# EAGLE design CNC1000 (EAGLE 6.4)
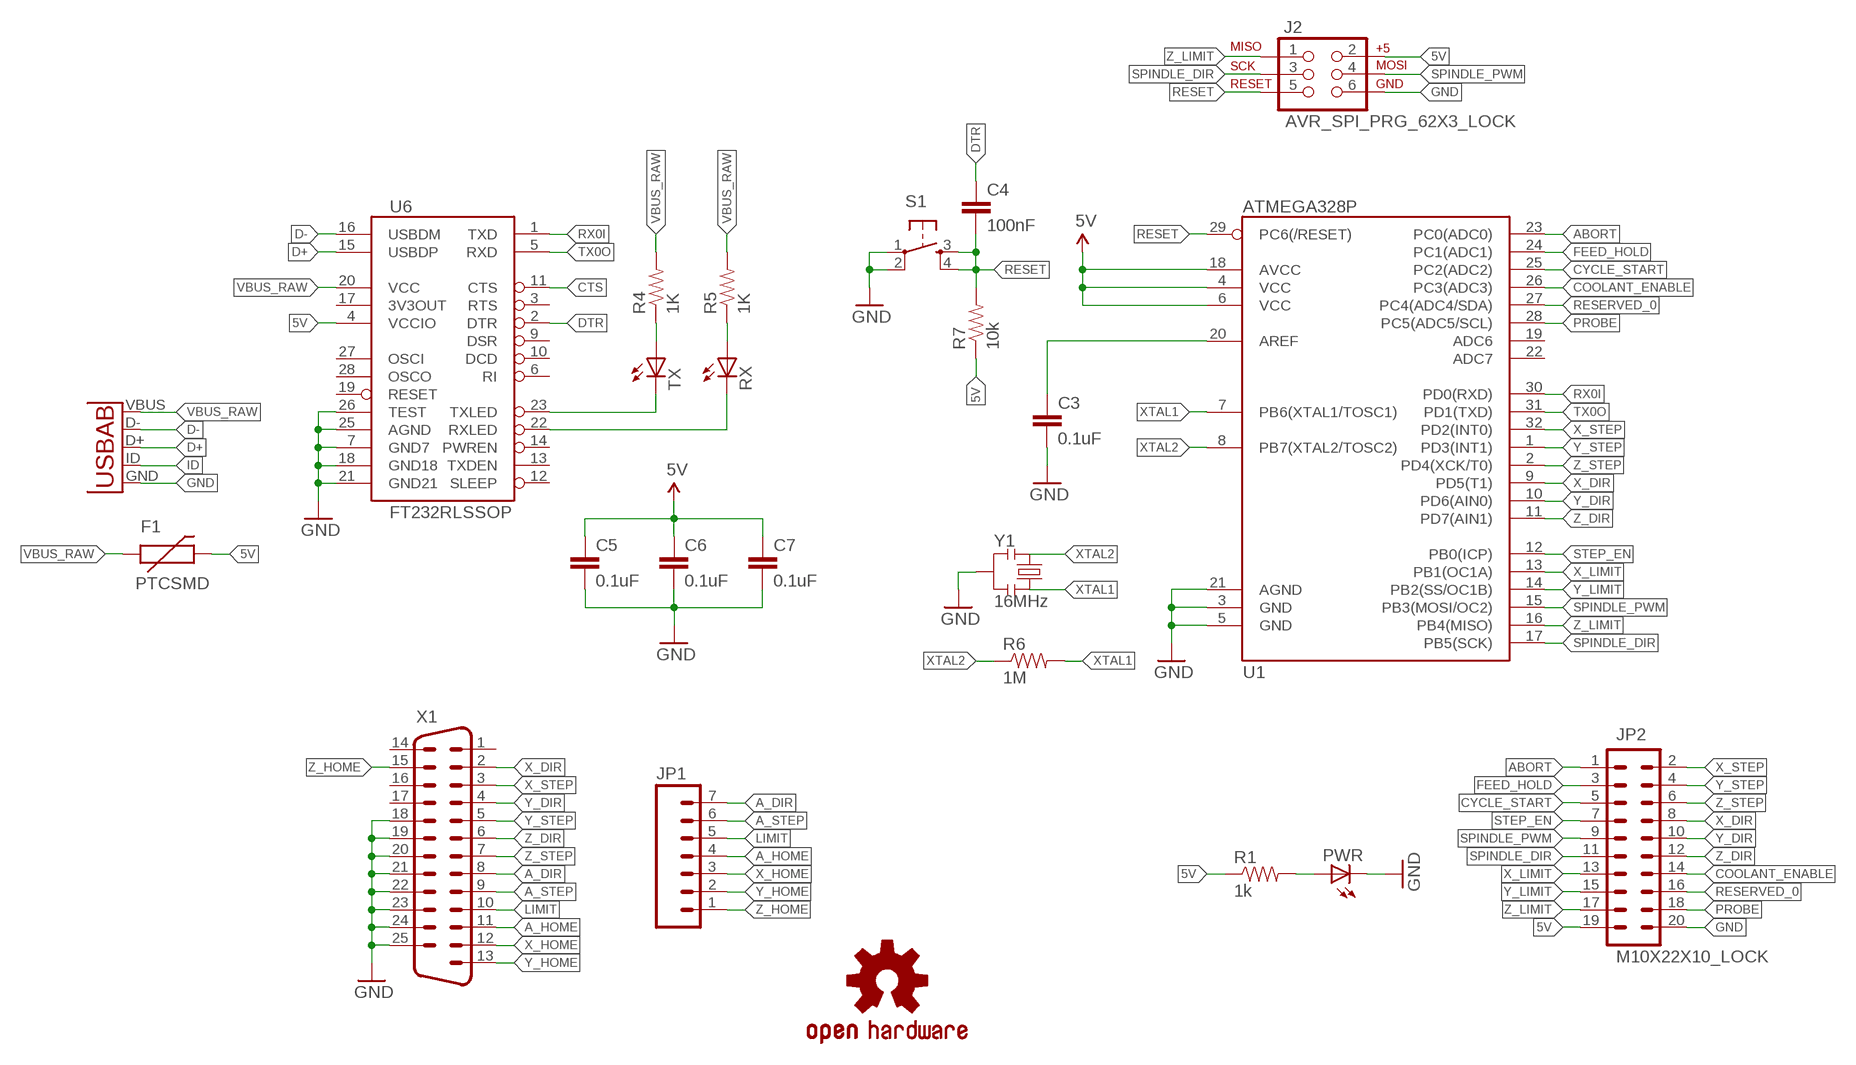
[diagram p0: schematic, sheet 1]

## Parts
C3  0.1uF  CAP0805  [0805]
C4  100nF  CAP0805  [0805]
C5  0.1uF  CAP0805  [0805]
C6  0.1uF  CAP0805  [0805]
C7  0.1uF  CAP0805  [0805]
F1  PTCSMD  [PTC-1206]
J2  AVR_SPI_PRG_62X3_LOCK  [2X3_LOCK]
JP1  M07LOCK  [1X07_LOCK]
JP2  M10X22X10_LOCK  [2X10_LOCK]
LOGO2  OSHW-LOGOM  [OSHW-LOGO-M]
PWR  LED0603  [LED-0603]
R1  1k  RESISTOR0805-RES  [0805]
R4  1K  RESISTOR0805-RES  [0805]
R5  1K  RESISTOR0805-RES  [0805]
R6  1M  RESISTOR0805-RES  [0805]
R7  10k  RESISTOR0805-RES  [0805]
RX  LED0603  [LED-0603]
S1  TAC_SWITCHSMD  [TACTILE_SWITCH_SMD]
TX  LED0603  [LED-0603]
U1  ATMEGA328P  ATMEGA328_SMT  [TQFP32-08]
U4  USB-AB"  [USB_AB_MICRO_1:1_V2]
U6  FT232RLSSOP  [SSOP28DB]
X1  DB25TE  [TE1734350]
Y1  16MHz  PRQC16.00SR1010V00LSMD  [PRQC16.00SR1010V00L]

## Nets
5V: C5.1 C6.1 C7.1 F1.2 J2.2 JP2.19 R1.1 R7.1 U1.4(VCC) U1.6(VCC) U1.18(AVCC) U6.4(VCCIO)
A_DIR: JP1.7 X1.8
A_HOME: JP1.4 X1.11
A_STEP: JP1.6 X1.9
ABORT: JP2.1 U1.23(PC0(ADC0))
COOLANT_ENABLE: JP2.14 U1.26(PC3(ADC3))
CTS: U6.11(CTS)
CYCLE_START: JP2.5 U1.25(PC2(ADC2))
D+: U4.D+ U6.15(USBDP)
D-: U4.D- U6.16(USBDM)
DTR: C4.1 U6.2(DTR)
FEED_HOLD: JP2.3 U1.24(PC1(ADC1))
GND: C3.2 C5.2 C6.2 C7.2 J2.6 JP2.20 PWR.C S1.1 S1.2 U1.3(GND) U1.5(GND) U1.21(AGND) U4.GND U6.7(GND7) U6.18(GND18) U6.21(GND21) U6.25(AGND) U6.26(TEST) X1.18 X1.19 X1.20 X1.21 X1.22 X1.23 X1.24 X1.25 Y1.P$2
ID: U4.ID(USBID)
LIMIT: JP1.5 X1.10
N$1: TX.C U6.23(TXLED)
N$3: RX.C U6.22(RXLED)
N$5: R4.1 TX.A
N$6: R5.1 RX.A
N$7: PWR.A R1.2
N$8: C3.1 U1.20(AREF)
PROBE: JP2.18 U1.28(PC5(ADC5/SCL))
RESERVED_0: JP2.16 U1.27(PC4(ADC4/SDA))
RESET: C4.2 J2.5 R7.2 S1.3 S1.4 U1.29(PC6(/RESET))
RX0I: U1.30(PD0(RXD)) U6.1(TXD)
SPINDLE_DIR: J2.3 JP2.11 U1.17(PB5(SCK))
SPINDLE_PWM: J2.4 JP2.9 U1.15(PB3(MOSI/OC2))
STEP_EN: JP2.7 U1.12(PB0(ICP))
TX0O: U1.31(PD1(TXD)) U6.5(RXD)
VBUS_RAW: F1.1 R4.2 R5.2 U4.VBUS U6.20(VCC)
X_DIR: JP2.8 U1.9(PD5(T1)) X1.2
X_HOME: JP1.3 X1.12
X_LIMIT: JP2.13 U1.13(PB1(OC1A))
X_STEP: JP2.2 U1.32(PD2(INT0)) X1.3
XTAL1: R6.2 U1.7(PB6(XTAL1/TOSC1)) Y1.P$3
XTAL2: R6.1 U1.8(PB7(XTAL2/TOSC2)) Y1.P$1
Y_DIR: JP2.10 U1.10(PD6(AIN0)) X1.4
Y_HOME: JP1.2 X1.13
Y_LIMIT: JP2.15 U1.14(PB2(SS/OC1B))
Y_STEP: JP2.4 U1.1(PD3(INT1)) X1.5
Z_DIR: JP2.12 U1.11(PD7(AIN1)) X1.6
Z_HOME: JP1.1 X1.15
Z_LIMIT: J2.1 JP2.17 U1.16(PB4(MISO))
Z_STEP: JP2.6 U1.2(PD4(XCK/T0)) X1.7
Unconnected: U1.19(ADC6) U1.22(ADC7) U6.3(RTS) U6.6(RI) U6.9(DSR) U6.10(DCD) U6.12(SLEEP) U6.13(TXDEN) U6.14(PWREN) U6.17(3V3OUT) U6.19(RESET) U6.27(OSCI) U6.28(OSCO) X1.1 X1.14 X1.16 X1.17

## Library data of the parts
C3 C4 = SparkFun-Capacitors:CAP: Capacitor Standard 0603 ceramic capacitor, and 0.1" leaded capacitor.
C5-C7 = evanli:CAP: Capacitor Standard 0603 ceramic capacitor, and 0.1" leaded capacitor.
F1 = SparkFun-PowerIC:PTC: Resettable Fuse PTC Resettable Fuse. Spark Fun Electronics SKU : COM-08357; PROD_ID: RES-11150
J2 = SparkFun-Connectors:AVR_SPI_PRG_6: AVR ISP 6 Pin This is the reduced ISP connector for AVR programming. Common on Arduino. This footprint will take up less PCB space and can be used with a 10-pin to 6-pin adapter such as SKU: BOB-08508
JP1 = SparkFun-Connectors:M07: Header 7 Standard 7-pin 0.1" header. Use with straight break away headers (SKU : PRT-00116), right angle break away headers (PRT-00553), swiss pins (PRT-00743), machine pins (PRT-00117), and female headers (PRT-00115). NOTES ON THE VARIANTS LOCK and LOCK_LONGPADS... This footprint was designed to help hold the alignment of a through-hole component (i.e. 7-pin header) while soldering it into place. You may notice that each hole has been shifted either up or down by 0.005 of an inch from it's more standard position (which is usually a perfectly straight line). This slight alteration caused the pins (the squares in the middle) to touch the edges of the holes. Because they are alternating, it causes a "brace" to hold the header in place. 0.005 has proven to be the perfect amount of "off-center" position when using our standard breakaway headers. Although looks a little odd when you look at the bare footprint, once you have a header in there, the alteration is very hard to notice. Also, if you push a header all the way into place, it is covered up entirely on the bottom side. This idea of altering the position of holes to aid alignment will be further integrated into the Sparkfun Library for other footprints. It can help hold any component with 3 or more connection pins.
JP2 = SparkFun-Connectors:M10X2: This was SPECIALLY designed to be used with our Graphic LCD Backpack. Be sure you want to use this! It is not only staggered on each line of header holes, but IT IS ALSO offset of the center point of the top and bottom lines by 5 mil. This causes the headers to lock into place on the "standard" footprint on the LCD screen. The extra squares on the tdocu layer are there simply to reference other pins (if you were to actually populate a longer header than ten long - this is what we do with the backpacks).
LOGO2 = SparkFun-Aesthetics:OSHW-LOGO: Open Source Hardware Logo This logo indicates the piece of hardware it is found on incorporates a OSHW license and/or adheres to the definition of open source hardware found here: http://freedomdefined.org/OSHW
PWR RX TX = SparkFun-LED:LED: LEDs Standard schematic elements and footprints for 5mm, 3mm, 1206, and 0603 sized LEDs. 5mm - Spark Fun Electronics SKU : COM-00529 (and others)
R1 R4-R7 = SparkFun-Resistors:RESISTOR: Resistor Basic schematic elements and footprints for 0603, 1206, and PTH resistors.
S1 = SparkFun-Electromechanical:TAC_SWITCH: Momentary Switch Button commonly used for reset or general input. Spark Fun Electronics SKU : COM-00097 SMT- SWCH-08247; PROD_ID: SWCH-08247
U1 = SparkFun-DigitalIC:ATMEGA328_SMT: 32-Pin Atmega328 part Commonly used on Arduino compatible boards Available in QFP and QFN packages TQFP is IC-09069 QFN is non-stock; PROD_ID: IC-09069
U4 = SparkFun-Connectors:USB-AB: This is a USB AB connector that is compatible with USB OTG. i.e. this connector can serve as a host or device
U6 = SparkFun-DigitalIC:FT232RL: USB UART FT232RL 4th Generation USB UART (USB <-> Serial) Controller. Spark Fun Electronics SKU : COM-00650 Production SKU IC-00870; PROD_ID: IC-00870
X1 = evanli:DB25: Various DB25 connectors
Y1 = evanli:PRQC16.00SR1010V00L

## Net classes
1 USB: drill 0.406 mm, clearance 0.203 mm to class 0, clearance 0.406 mm
3 usbvcc: width 0.61 mm, drill 0.508 mm, clearance 0.203 mm to class 0, clearance 0.254 mm

## Board
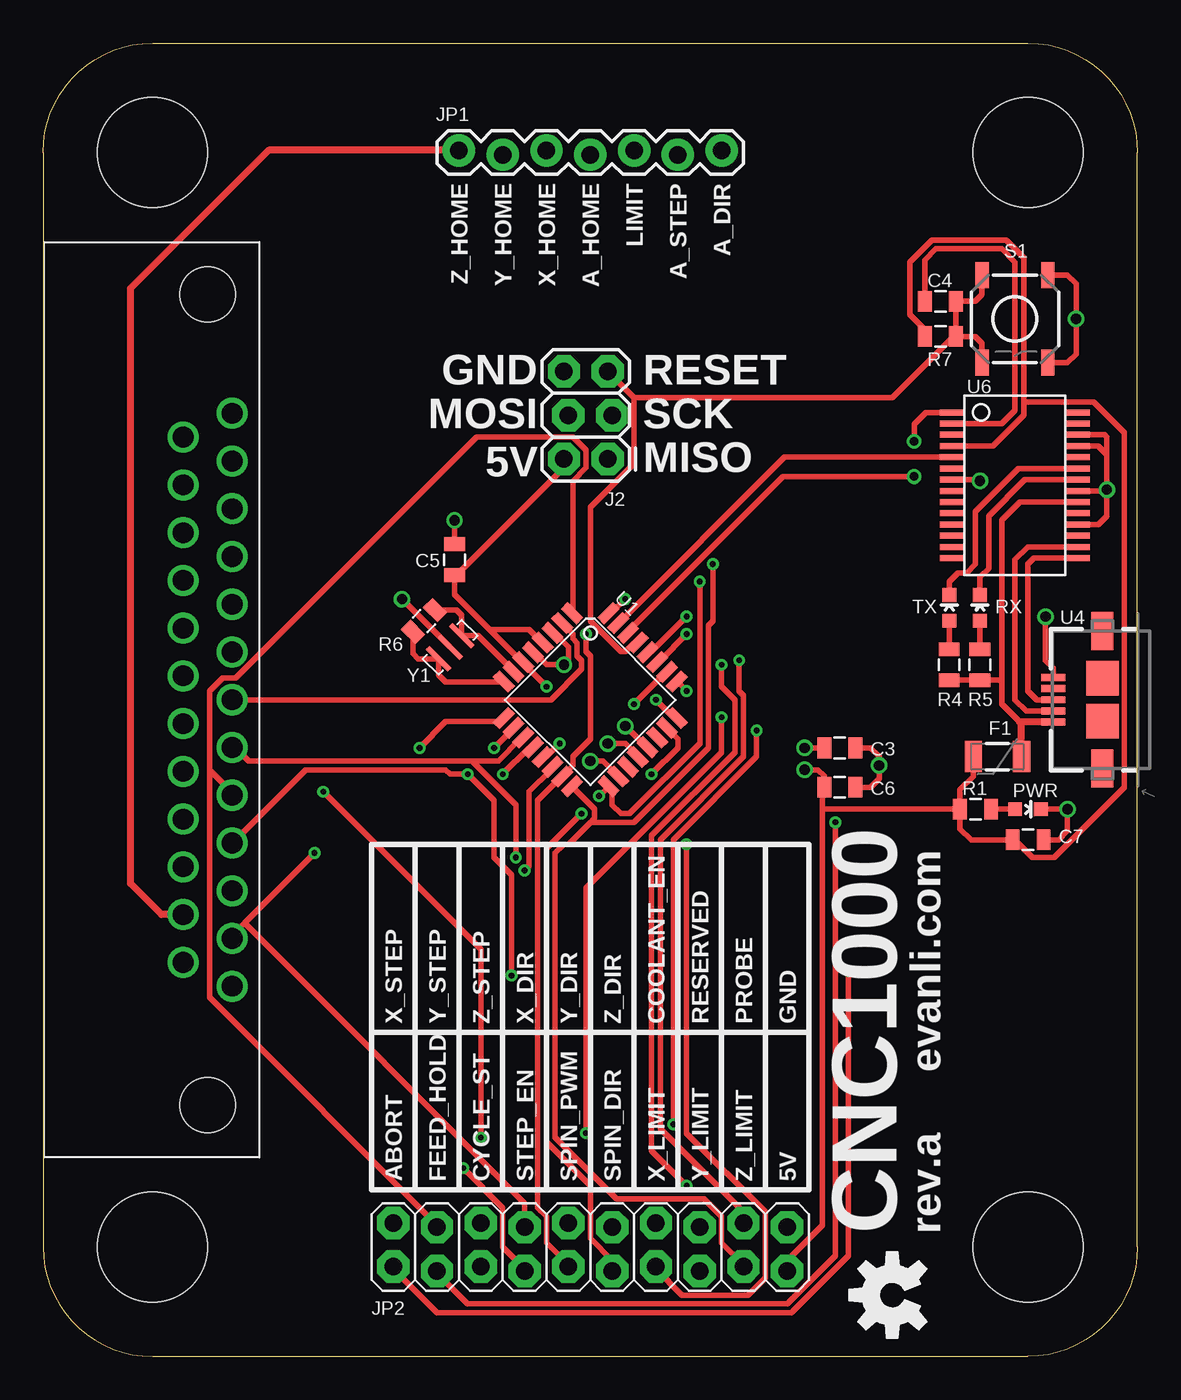
[diagram p1: board, top side]
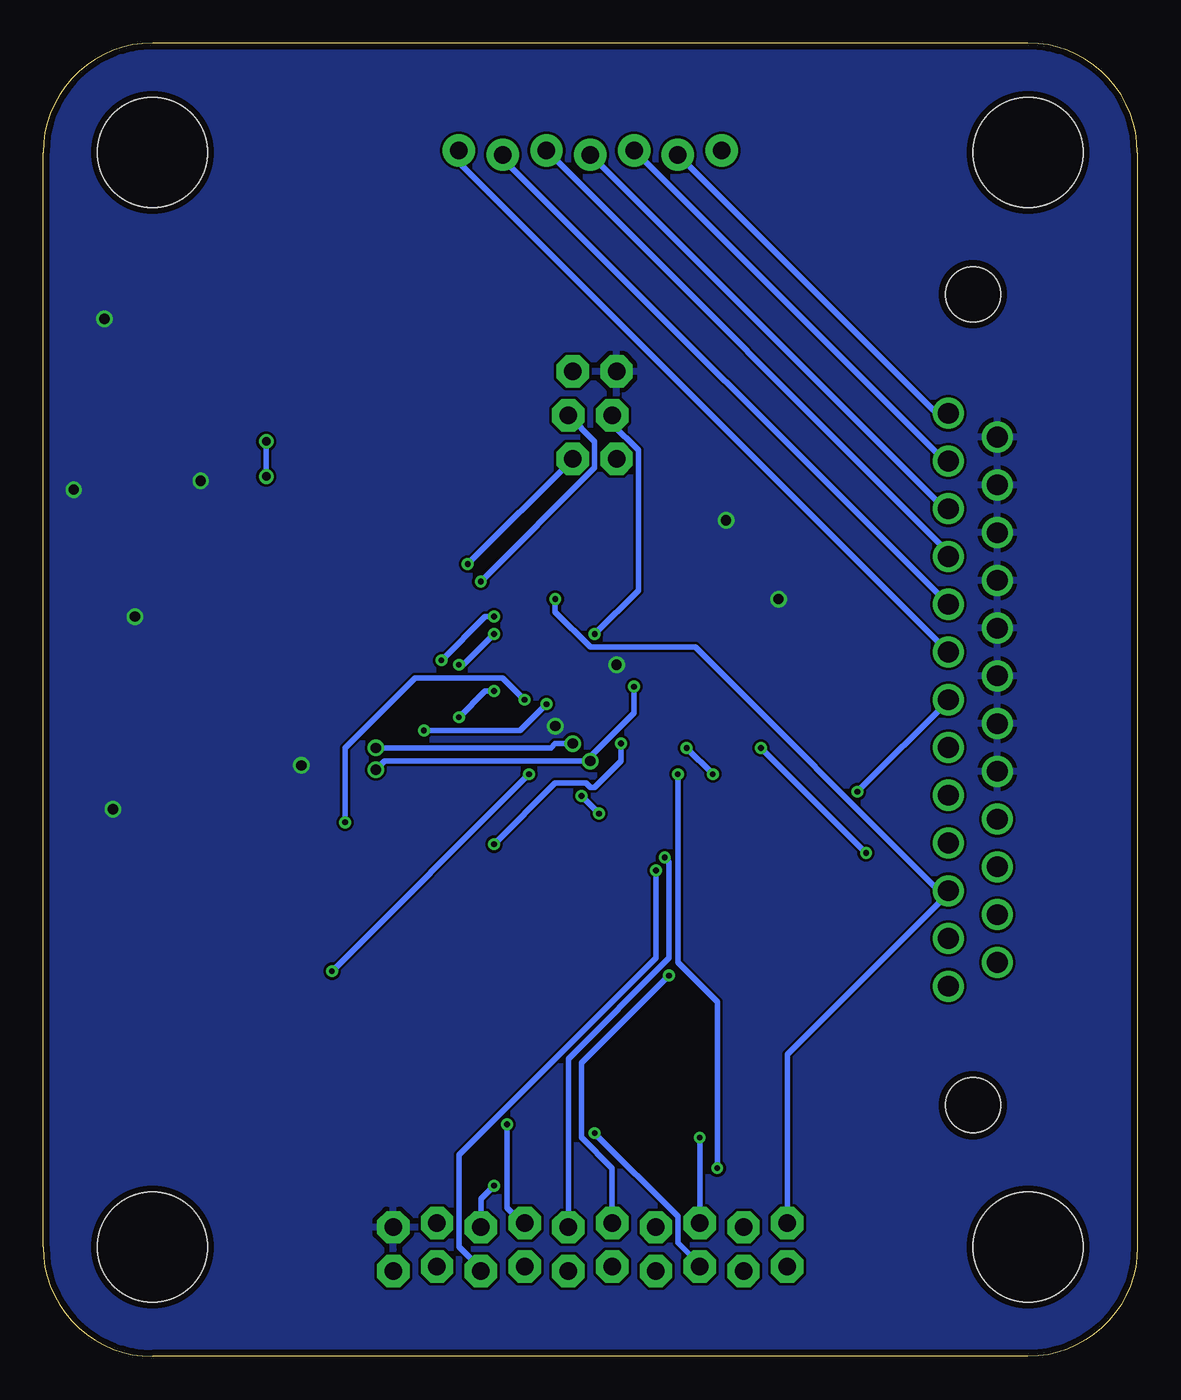
[diagram p2: board, bottom side, seen from below]

Size 63.5 x 76.2 mm. Coordinates in mm from the lower left corner, seen from the top.
Outline: 63.5,6.35 63.5,69.85 arc90 57.15,76.2 6.35,76.2 arc90 0,69.85 0,6.35 arc90 6.35,0 57.15,0 arc90 63.5,6.35
Copper layers (1*16): Top 0.0356mm / dielectric 1.5011mm / Bottom 0.0356mm
Design rules "OSHPARK_LaenPCBOrder": minimum track width 6mil, minimum drill 13mil, track to track 6mil, track to pad 6mil, pad to pad 6mil, via to via 6mil, smd to smd 6mil, copper to edge 15mil, drill to drill 6mil, minimum pad ring 7mil, minimum via ring 7mil, stop-mask expansion 3mil, vias tented up to drill 0mil, thermal gap 10mil
Holes 6.35 mm at 6.35,6.35 57.15,6.35 57.15,69.85 6.35,69.85

### Footprints (pad centres in the part's own frame; a part is rotated, then mirrored left to right if it is on the bottom)
0805 = smd 0.8 x 1.2: 1 -0.9,0; 2 0.9,0
PTC-1206 = smd 1 x 1.8: 1 -1.4,0; 2 1.4,0
2X3_LOCK = drill 1.016 pad 1.88 octagon: 1 0,0; 2 0,2.54; 3 2.54,-0.254; 4 2.54,2.286; 5 5.08,0; 6 5.08,2.54
1X07_LOCK = drill 1.016 pad 1.88: 1 0,0.127; 2 2.54,-0.127; 3 5.08,0.127; 4 7.62,-0.127; 5 10.16,0.127; 6 12.7,-0.127; 7 15.24,0.127
2X10_LOCK = drill 1.016 pad 1.88 octagon: 1 -11.43,-1.143; 2 -11.43,1.397; 3 -8.89,-1.397; 4 -8.89,1.143; 5 -6.35,-1.143; 6 -6.35,1.397; 7 -3.81,-1.397; 8 -3.81,1.143; 9 -1.27,-1.143; 10 -1.27,1.397; 11 1.27,-1.397; 12 1.27,1.143; 13 3.81,-1.143; 14 3.81,1.397; 15 6.35,-1.397; 16 6.35,1.143; 17 8.89,-1.143; 18 8.89,1.397; 19 11.43,-1.397; 20 11.43,1.143
LED-0603 = smd 0.8 x 0.8: A 0,-0.75; C 0,0.75
TACTILE_SWITCH_SMD = smd 1.524 x 0.762: 1 -2.54,1.905; 2 2.54,1.905; 3 -2.54,-1.905; 4 2.54,-1.905
TQFP32-08 = smd 1.27 x 0.559: 1 -4.293,2.8; 2 -4.293,2; 3 -4.293,1.2; 4 -4.293,0.4; 5 -4.293,-0.4; 6 -4.293,-1.2; 7 -4.293,-2; 8 -4.293,-2.8; 17 4.293,-2.8; 18 4.293,-2; 19 4.293,-1.2; 20 4.293,-0.4; 21 4.293,0.4; 22 4.293,1.2; 23 4.293,2; 24 4.293,2.8 | smd 0.559 x 1.27: 9 -2.8,-4.293; 10 -2,-4.293; 11 -1.2,-4.293; 12 -0.4,-4.293; 13 0.4,-4.293; 14 1.2,-4.293; 15 2,-4.293; 16 2.8,-4.293; 25 2.8,4.293; 26 2,4.293; 27 1.2,4.293; 28 0.4,4.293; 29 -0.4,4.293; 30 -1.2,4.293; 31 -2,4.293; 32 -2.8,4.293
USB_AB_MICRO_1:1_V2 = smd 1.4 x 0.4: D+ 2.85,0; D- 2.85,0.65; GND 2.85,-1.3; ID 2.85,-0.65; VBUS 2.85,1.3 | smd 1.9 x 2: P$6 0,1.25; P$7 0,-1.25 | smd 1.27 x 2.2: P$8 0,4; P$9 0,-4
SSOP28DB = smd 0.348 x 1.397: 1 -4.225,-3.656; 2 -3.575,-3.656; 3 -2.925,-3.656; 4 -2.275,-3.656; 5 -1.625,-3.656; 6 -0.975,-3.656; 7 -0.325,-3.656; 8 0.325,-3.656; 9 0.975,-3.656; 10 1.625,-3.656; 11 2.275,-3.656; 12 2.925,-3.656; 13 3.575,-3.656; 14 4.225,-3.656; 15 4.225,3.656; 16 3.575,3.656; 17 2.925,3.656; 18 2.275,3.656; 19 1.625,3.656; 20 0.975,3.656; 21 0.325,3.656; 22 -0.325,3.656; 23 -0.975,3.656; 24 -1.625,3.656; 25 -2.275,3.656; 26 -2.925,3.656; 27 -3.575,3.656; 28 -4.225,3.656
TE1734350 = drill 1.2: 1 16.62,2.84; 2 13.85,2.84; 3 11.08,2.84; 4 8.31,2.84; 5 5.54,2.84; 6 2.77,2.84; 7 0,2.84; 8 -2.77,2.84; 9 -5.54,2.84; 10 -8.31,2.84; 11 -11.08,2.84; 12 -13.85,2.84; 13 -16.62,2.84; 14 15.235,0; 15 12.465,0; 16 9.695,0; 17 6.925,0; 18 4.155,0; 19 1.385,0; 20 -1.385,0; 21 -4.155,0; 22 -6.925,0; 23 -9.695,0; 24 -12.465,0; 25 -15.235,0 | hole 3.18: -23.52,1.42; 23.52,1.42
PRQC16.00SR1010V00L = smd 0.3 x 1.8: P$1 -0.95,0; P$2 0,0; P$3 0.95,0

### Placement (x,y rotation side)
C3  46.23,35.31 0 top
C4  52.07,61.21 0 top
C5  23.88,46.23 90 top
C6  46.23,33.02 0 top
C7  57.15,29.97 0 top
F1  55.37,34.8 180 top
J2  32.77,52.07 90 top
JP1  24.13,69.85 0 top
JP2  31.75,6.35 0 top
LOGO2  49.28,3.56 90 top
PWR  57.15,31.75 270 top
R1  54.1,31.75 0 top
R4  52.58,40.13 270 top
R5  54.36,40.13 270 top
R6  22.1,42.67 45 top
R7  52.07,59.18 0 top
RX  54.36,43.43 0 top
S1  56.39,60.2 270 top
TX  52.58,43.43 0 top
U1  31.75,38.1 315 top
U4  61.47,38.1 180 top
U6  56.39,50.55 270 top
X1  8.13,38.1 270 top
Y1  23.62,41.15 45 top

### Tracks (layer width: path | path; a pad name or v marks a point on that pad's centre or on a via)
5V  (via drill 0.33, 0.6)
  Top 0.305: F1.2 53.97,33.65 53.2,32.88 R1.1 | 25.91,42.16 27.79,40.29 U1.6 27.94,40.13 v29.21,38.86 | 25.91,42.16 23.88,44.2 23.88,45.21 | U1.4 28.94,41.42 28.19,42.16 25.91,42.16 | v31.75,34.54 32.48,34.54 U1.18 | v44.2,34.04 44.96,34.04 45.33,33.67 C6.1 45.21,33.02 45.21,31.75 | R1.1 53.2,30.62 53.85,29.97 C7.1 56.39,29.97 57.4,28.96 58.67,28.96 62.74,33.02 62.74,53.59 60.96,55.37 56.9,55.37 | 56.9,55.37 56.9,54.61 55.12,52.83 52.83,52.83 U6.4 | 56.9,55.37 56.9,63.75 55.88,64.77 51.56,64.77 50.29,63.5 50.29,60.45 51.05,59.69 51.05,59.18 R7.1 | J2.2 30.23,51.56 23.88,45.21 | 23.88,45.21 C5.1 | JP2.19 43.18,5.59 45.21,7.62 45.21,31.75 | 45.21,31.75 R1.1
  Bottom 0.305: 32,34.54 43.69,34.54 v44.2,34.04 | v29.21,38.86 29.21,37.34 32,34.54 | 32,34.54 v31.75,34.54
A_DIR
  Bottom 0.305: JP1.7 39.37,69.27 X1.8
A_HOME
  Bottom 0.305: X1.11 11.21,49.18 JP1.4
A_STEP
  Bottom 0.305: JP1.6 36.83,69.5 X1.9
ABORT  (via drill 0.33)
  Top 0.305: v35.31,33.78 36.83,35.31 36.83,35.81 36.32,36.32 U1.23 | v46.74,22.35 46.74,5.84 43.43,2.54 22.86,2.54 20.32,5.08 JP2.1
  Bottom 0.305: v46.74,22.35 v35.31,33.78
COOLANT_ENABLE  (via drill 0.33)
  Top 0.305: v34.29,37.85 36.07,39.62 U1.26 | v41.4,36.32 41.4,34.8 36.58,29.97 v36.58,13.46
  Bottom 0.305: v34.29,37.85 35.81,36.32 v41.4,36.32 | v36.58,13.46 36.58,8.64 35.56,7.62 JP2.14
CYCLE_START  (via drill 0.33)
  Top 0.305: v37.34,38.61 36.83,39.12 U1.25 | v39.37,37.08 39.37,35.05 31.5,27.18 v31.5,12.95
  Bottom 0.305: v37.34,38.61 37.85,38.61 v39.37,37.08 | v31.5,12.95 26.67,8.13 26.67,6.6 25.4,5.33 JP2.5
D+
  Top 0.305: U4.D+ 57.66,38.1 57.15,38.61 57.15,45.97 57.5,46.32 U6.15
D-
  Top 0.305: U4.D- 57.04,37.45 56.39,38.1 56.39,46.23 57.13,46.97 U6.16
DTR
  Top 0.305: U6.2 55.65,54.12 56.39,54.86 56.39,63.5 55.63,64.26 51.82,64.26 51.17,63.62 C4.1
FEED_HOLD  (via drill 0.33)
  Top 0.305: v35.56,38.1 36.58,37.08 U1.24 | v45.97,30.99 45.97,5.84 43.18,3.05 24.64,3.05 22.86,4.83 JP2.3
  Bottom 0.305: v35.56,38.1 36.83,39.37 41.91,39.37 45.97,35.31 v45.97,30.99
GND  (via drill 0.6)
  Top 0.305: S1.1 59.44,62.74 59.94,62.23 v59.94,60.2 59.94,58.17 59.44,57.66 S1.2 | U4.GND 58.62,39.93 58.17,40.39 v58.17,42.93 | U6.7 54.28,50.87 v54.36,50.8 | U6.21 61.65,50.22 v61.72,50.29 | U6.18 61.23,48.27 61.72,48.77 v61.72,50.29 | U6.25 61.23,52.82 61.72,52.32 | 61.72,52.32 v61.72,50.29 | U6.26 61.59,53.47 61.72,53.34 61.72,52.32 | PWR.C v59.44,31.75 59.44,30.48 58.93,29.97 C7.2 | Y1.P$2 v20.83,43.94 | 29.21,42.16 29.46,41.91 U1.3 29.64,41.98 30.48,41.15 30.48,40.39 v30.23,40.13 29.21,40.13 28.49,40.85 U1.5 | U1.21 35.01,35.35 v33.78,36.58 | C3.2 48.01,35.31 48.51,34.8 v48.51,34.29 48.51,33.53 48.01,33.02 C6.2 | C5.2 v23.88,48.51
  pour Bottom: 0,6.35 0,69.85 arc-90 6.35,76.2 57.15,76.2 arc-90 63.5,69.85 63.5,6.35 arc-90 57.15,0 6.35,0 arc-90
LIMIT
  Bottom 0.305: X1.10 10.97,46.66 JP1.5
N$1
  Top 0.305: TX.C 52.58,44.96 53.09,45.47 53.59,45.47 54.1,45.97 54.1,49.02 56.6,51.52 U6.23
N$3
  Top 0.305: RX.C 54.36,45.21 54.86,45.72 54.86,48.77 56.97,50.87 U6.22
N$5
  Top 0.305: R4.1 TX.A
N$6
  Top 0.305: R5.1 RX.A
N$7
  Top 0.305: R1.2 PWR.A
N$8  (via drill 0.6)
  Top 0.305: U1.20 34.5,34.84 33.78,35.56 v32.77,35.56 | v44.2,35.31 C3.1
  Bottom 0.305: v44.2,35.31 34.04,35.31 33.78,35.56 v32.77,35.56
PROBE  (via drill 0.33)
  Top 0.305: v37.34,42.93 35.31,40.89 U1.28 | v40.39,40.39 40.39,38.61 40.64,38.35 40.64,34.8 35.81,29.97 35.81,13.21 40.64,8.38 JP2.18
  Bottom 0.305: v37.34,42.93 37.85,42.93 v40.39,40.39
RESERVED_0  (via drill 0.33)
  Top 0.305: v37.34,41.91 35.81,40.39 U1.27 | v39.37,40.13 39.37,38.86 40.13,38.1 40.13,35.05 35.31,30.23 35.31,11.94 v37.34,9.91
  Bottom 0.305: v37.34,41.91 39.12,40.13 v39.37,40.13 | v37.34,9.91 38.1,9.14 JP2.16
RESET
  Top 0.305: S1.3 54.48,61.59 54.1,61.21 C4.2 R7.2 | S1.4 54.48,58.8 54.1,59.18 R7.2 | 34.29,55.63 34.29,51.82 31.75,49.28 31.75,42.67 33.53,40.89 33.78,40.89 34.29,41.4 U1.29 | J2.5 34.29,55.63 | 34.29,55.63 49.28,55.63 52.83,59.18 R7.2
RX0I  (via drill 0.5)
  Top 0.305: U1.30 33.94,42.06 42.93,51.05 v50.55,51.05 | U6.1 51.22,54.77 50.55,54.1 v50.55,53.09
  Bottom 0.305: v50.55,53.09 v50.55,51.05
SPINDLE_DIR  (via drill 0.33)
  Top 0.305: v38.1,44.96 38.1,35.56 34.04,31.5 33.53,31.5 33.02,32 33.02,33.02 U1.17 32.77,33.02 v32.26,32.51 | JP2.11 33.02,5.59 31.75,6.86 31.75,9.91 29.21,12.45 29.21,29.46 v31.24,31.5
  Bottom 0.305: v38.1,44.96 31.5,51.56 31.5,53.09 J2.3 | v32.26,32.51 v31.24,31.5
SPINDLE_PWM  (via drill 0.33)
  Top 0.305: JP2.9 30.48,5.33 29.21,6.6 29.21,8.13 28.7,8.64 28.7,32.26 29.97,33.53 U1.15 30.23,33.78 30.73,34.29 30.73,34.8 31.75,35.81 31.75,40.64 31.5,40.89 v31.5,41.91
  Bottom 0.305: J2.4 30.48,54.1 28.96,52.58 28.96,44.45 v31.5,41.91
STEP_EN  (via drill 0.33)
  Top 0.305: v26.67,33.78 28.19,35.31 U1.12 | JP2.7 27.94,5.08 26.67,6.35 26.67,8.64 v24.38,10.92
  Bottom 0.305: v26.67,33.78 26.67,22.86 24.38,20.57 v24.38,10.92
TX0O
  Top 0.305: U1.31 33.41,42.55 43.03,52.17 U6.5
VBUS_RAW
  Top 0.305: 56.67,36.8 55.63,37.85 55.63,39.12 | 55.63,39.12 55.63,48.51 56.68,49.57 U6.20 | R4.2 R5.2 55.51,39.23 55.63,39.12
  Top 0.406: U4.VBUS 56.67,36.8 56.77,36.7 F1.1
X_DIR  (via drill 0.33)
  Top 0.305: v21.84,35.31 23.37,36.83 26.67,36.83 U1.9 | 11.68,25.15 10.92,24.38 X1.2 | 11.68,25.15 v15.75,29.21 | JP2.8 27.94,8.89 11.68,25.15
  Bottom 0.305: v15.75,29.21 v21.84,35.31
X_HOME
  Bottom 0.305: X1.12 11.18,51.95 JP1.3
X_LIMIT  (via drill 0.33)
  Top 0.305: v29.97,35.56 29.21,34.8 U1.13 | v37.34,29.72 37.34,12.95 41.91,8.38 41.91,4.57 40.89,3.56 37.08,3.56 35.56,5.08 JP2.13
  Bottom 0.305: v29.97,35.56 29.97,34.54 31.5,33.02 31.75,33.02 32,33.27 33.78,33.27 v37.34,29.72
X_STEP  (via drill 0.33)
  Top 0.305: v33.78,43.94 33.02,43.18 U1.32
  Bottom 0.305: v33.78,43.94 33.78,43.18 31.75,41.15 25.65,41.15 11.68,27.18 11.18,27.18 X1.3 10.92,26.92 20.32,17.53 JP2.2
XTAL1
  Top 0.305: R6.2 24,43.31 24.29,43.02 Y1.P$3 25.24,41.82 27.3,39.76 U1.7
XTAL2
  Top 0.305: 26.63,39.16 U1.8 26.7,39.12 23.37,39.12 22.95,39.53 Y1.P$1 21.75,40.48 21.46,40.77 R6.1
Y_DIR  (via drill 0.33)
  Top 0.305: v26.16,35.31 27.18,36.32 U1.10 | X1.4 11.18,29.97 15.24,34.04 23.37,34.04 23.62,33.78 v24.64,33.78 26.16,32.26 26.16,28.96 27.18,27.94 v27.18,22.1
  Bottom 0.305: v24.64,33.78 v26.16,35.31 | JP2.10 30.48,10.92 32.26,12.7 32.26,17.02 v27.18,22.1
Y_HOME
  Bottom 0.305: X1.13 11.67,54.72 JP1.2
Y_LIMIT  (via drill 0.33)
  Top 0.305: v27.94,28.19 28.19,28.45 28.19,32.77 29.46,34.04 U1.14
  Bottom 0.305: v27.94,28.19 27.94,23.11 39.37,11.68 39.37,6.35 38.1,5.08 JP2.15
Y_STEP
  Top 0.305: 9.65,34.04 9.65,38.61 10.41,39.37 11.18,39.37 25.15,53.34 30.73,53.34 31.5,52.58 31.5,51.56 30.73,50.8 30.73,43.18 U1.1 | 9.65,34.04 10.92,32.77 X1.5 | 9.65,34.04 9.65,20.83 22.86,7.62 JP2.4
Z_DIR  (via drill 0.33)
  Top 0.305: 24.89,34.54 11.94,34.54 11.18,35.31 X1.6 | 24.89,34.54 26.42,34.54 27.69,35.81 U1.11 | v27.43,28.96 27.43,32 24.89,34.54
  Bottom 0.305: JP2.12 33.02,17.27 27.18,23.11 27.18,28.7 v27.43,28.96
Z_HOME
  Top 0.406: X1.15 6.88,25.64 5.08,27.43 5.08,61.98 13.08,69.98 JP1.1
Z_LIMIT  (via drill 0.33)
  Top 0.305: 31.75,30.99 30.48,29.72 30.23,29.72 29.72,29.21 29.72,12.7 33.27,9.14 38.35,9.14 39.37,8.13 39.37,6.6 40.64,5.33 JP2.17 | 31.75,30.99 32,31.24 32,31.75 30.73,33.02 U1.16 | v38.86,45.97 38.86,42.67 38.61,42.42 38.61,35.31 34.29,30.99 31.75,30.99
  Bottom 0.305: v38.86,45.97 J2.1
Z_STEP  (via drill 0.33)
  Top 0.305: X1.7 29.46,38.1 31.24,39.88 31.24,40.39 30.99,40.64 30.99,41.4 30.73,41.66 30.73,41.91 30.23,42.42 U1.2 | v25.4,12.7 25.4,23.62 v16.26,32.77
  Bottom 0.305: v25.4,12.7 JP2.6 | v16.26,32.77 10.92,38.1 X1.7

### Text on the board
tNames: Z_HOME | Y_HOME | X_HOME | A_HOME | LIMIT | A_STEP | A_DIR | GND | MOSI | RESET | SCK | 5V | MISO | X_STEP | Y_STEP | Z_STEP | X_DIR | Y_DIR | Z_DIR | COOLANT_EN | RESERVED | PROBE | GND | evanli.com | ABORT | FEED_HOLD | CYCLE_ST | STEP_EN | SPIN_PWM | SPIN_DIR | X_LIMIT | Y_LIMIT | Z_LIMIT | 5V | CNC1000 | rev.a